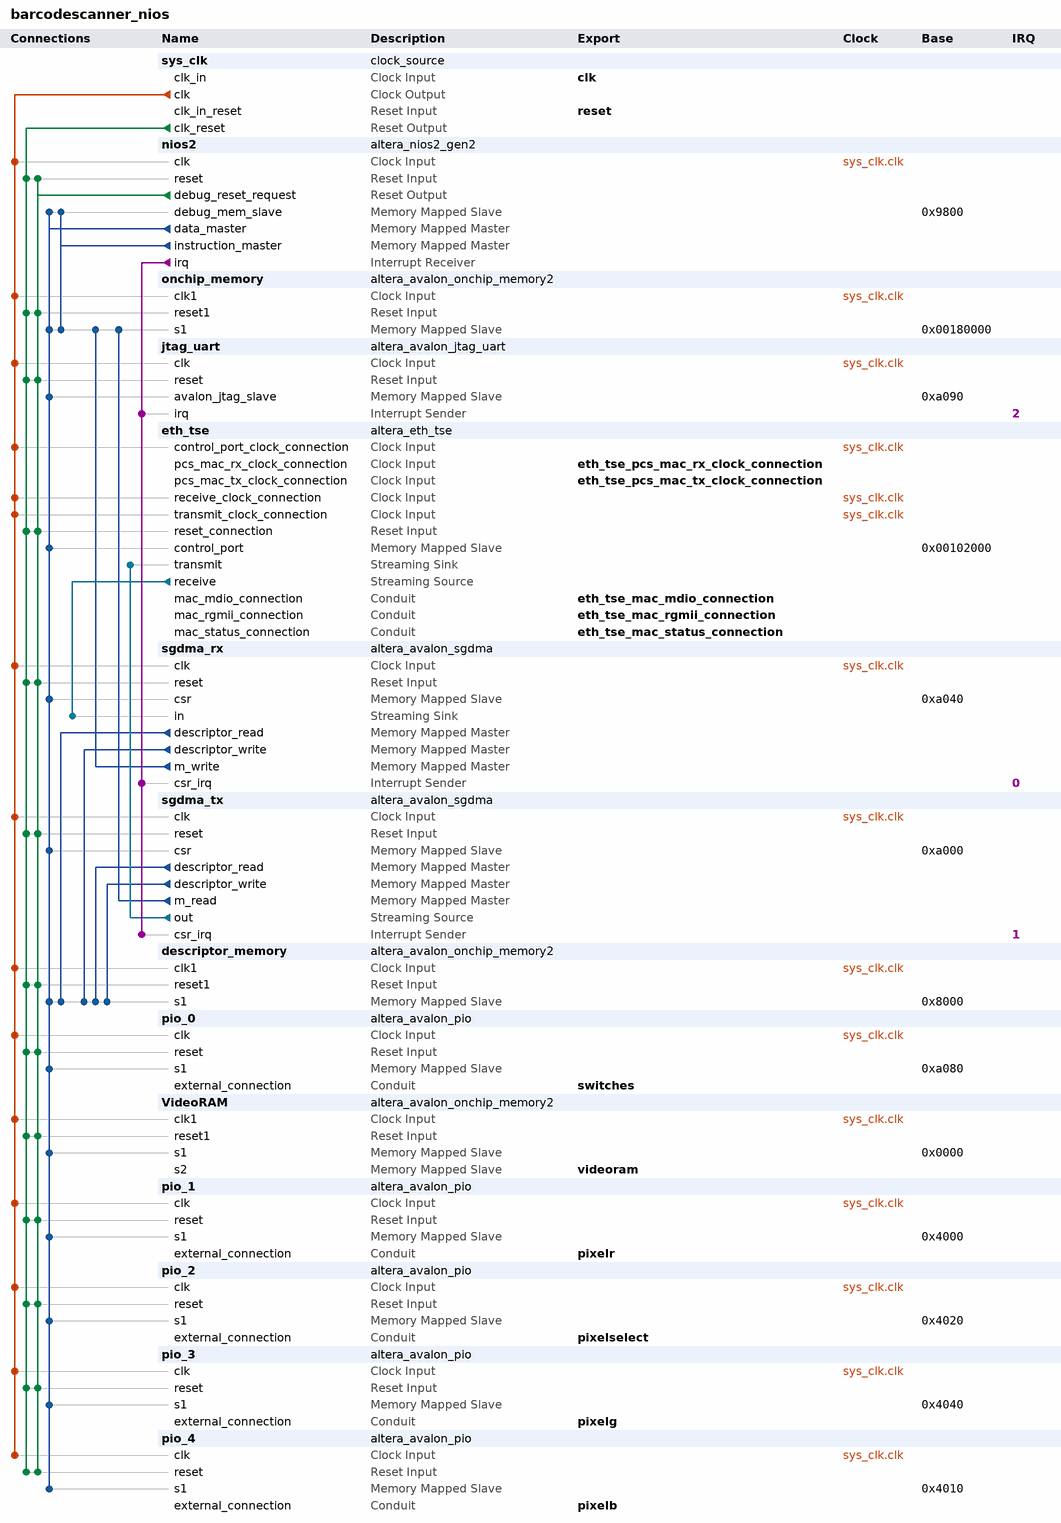
[diagram p0: system contents]
# Platform Designer (Qsys) system barcodescanner_nios, Cyclone IV E EP4CE115F29C7
# Parameters at their usual value, and those the tool derives, are not listed.
package require -exact qsys 18.1
create_system barcodescanner_nios
set_project_property DEVICE_FAMILY {Cyclone IV E}
set_project_property DEVICE EP4CE115F29C7

add_instance sys_clk clock_source 18.1
set_instance_parameter_value sys_clk clockFrequency 50000000

add_instance nios2 altera_nios2_gen2 18.1
set_instance_parameter_value nios2 dcache_size 0
set_instance_parameter_value nios2 exceptionSlave onchip_memory.s1
set_instance_parameter_value nios2 icache_size 4096
set_instance_parameter_value nios2 impl Tiny
set_instance_parameter_value nios2 resetSlave onchip_memory.s1
set_instance_parameter_value nios2 setting_activateTrace true
set_instance_parameter_value nios2 setting_branchpredictiontype Static

add_instance onchip_memory altera_avalon_onchip_memory2 18.1
set_instance_parameter_value onchip_memory dataWidth 32
set_instance_parameter_value onchip_memory dualPort false
set_instance_parameter_value onchip_memory initMemContent true
set_instance_parameter_value onchip_memory initializationFileName onchip_mem.hex
set_instance_parameter_value onchip_memory memorySize 307200

add_instance jtag_uart altera_avalon_jtag_uart 18.1
set_instance_parameter_value jtag_uart simInteractiveOptions NO_INTERACTIVE_WINDOWS

add_instance eth_tse altera_eth_tse 18.1
set_instance_parameter_value eth_tse XCVR_RCFG_JTAG_ENABLE 0
set_instance_parameter_value eth_tse XCVR_SET_CAPABILITY_REG_ENABLE 0
set_instance_parameter_value eth_tse XCVR_SET_CSR_SOFT_LOGIC_ENABLE 0
set_instance_parameter_value eth_tse XCVR_SET_PRBS_SOFT_LOGIC_ENABLE 0
set_instance_parameter_value eth_tse XCVR_SET_USER_IDENTIFIER 0
set_instance_parameter_value eth_tse core_variation MAC_ONLY
set_instance_parameter_value eth_tse enable_hd_logic true
set_instance_parameter_value eth_tse enable_mac_flow_ctrl false
set_instance_parameter_value eth_tse enable_magic_detect true
set_instance_parameter_value eth_tse enable_shift16 true
set_instance_parameter_value eth_tse ifGMII RGMII
set_instance_parameter_value eth_tse ing_addr 11
set_instance_parameter_value eth_tse mdio_clk_div 40
set_instance_parameter_value eth_tse stat_cnt_ena true
set_instance_parameter_value eth_tse transceiver_type NONE

add_instance sgdma_rx altera_avalon_sgdma 18.1
set_instance_parameter_value sgdma_rx enableBurstTransfers false
set_instance_parameter_value sgdma_rx enableUnalignedTransfers false
set_instance_parameter_value sgdma_rx readBlockDataWidth 32
set_instance_parameter_value sgdma_rx sinkErrorWidth 6
set_instance_parameter_value sgdma_rx sourceErrorWidth 0
set_instance_parameter_value sgdma_rx transferMode STREAM_TO_MEMORY
set_instance_parameter_value sgdma_rx writeBurstcountWidth 4

add_instance sgdma_tx altera_avalon_sgdma 18.1
set_instance_parameter_value sgdma_tx enableBurstTransfers false
set_instance_parameter_value sgdma_tx enableUnalignedTransfers false
set_instance_parameter_value sgdma_tx readBlockDataWidth 32
set_instance_parameter_value sgdma_tx sinkErrorWidth 0
set_instance_parameter_value sgdma_tx sourceErrorWidth 1
set_instance_parameter_value sgdma_tx transferMode MEMORY_TO_STREAM
set_instance_parameter_value sgdma_tx writeBurstcountWidth 4

add_instance descriptor_memory altera_avalon_onchip_memory2 18.1
set_instance_parameter_value descriptor_memory dataWidth 32
set_instance_parameter_value descriptor_memory dualPort false
set_instance_parameter_value descriptor_memory initMemContent true
set_instance_parameter_value descriptor_memory initializationFileName onchip_mem.hex
set_instance_parameter_value descriptor_memory memorySize 4096

add_instance pio_0 altera_avalon_pio 18.1
set_instance_parameter_value pio_0 direction Input
set_instance_parameter_value pio_0 width 8

add_instance VideoRAM altera_avalon_onchip_memory2 18.1
set_instance_parameter_value VideoRAM dataWidth 32
set_instance_parameter_value VideoRAM dualPort true
set_instance_parameter_value VideoRAM initMemContent true
set_instance_parameter_value VideoRAM initializationFileName onchip_mem.hex
set_instance_parameter_value VideoRAM memorySize 10000
set_instance_parameter_value VideoRAM singleClockOperation true

add_instance pio_1 altera_avalon_pio 18.1
set_instance_parameter_value pio_1 direction Input
set_instance_parameter_value pio_1 width 8

add_instance pio_2 altera_avalon_pio 18.1
set_instance_parameter_value pio_2 bitModifyingOutReg true
set_instance_parameter_value pio_2 direction Output
set_instance_parameter_value pio_2 width 8

add_instance pio_3 altera_avalon_pio 18.1
set_instance_parameter_value pio_3 direction Input
set_instance_parameter_value pio_3 width 8

add_instance pio_4 altera_avalon_pio 18.1
set_instance_parameter_value pio_4 direction Input
set_instance_parameter_value pio_4 width 8

# connections
add_connection sys_clk.clk descriptor_memory.clk1 clock
add_connection sys_clk.clk eth_tse.control_port_clock_connection clock
add_connection sys_clk.clk eth_tse.receive_clock_connection clock
add_connection sys_clk.clk eth_tse.transmit_clock_connection clock
add_connection sys_clk.clk jtag_uart.clk clock
add_connection sys_clk.clk nios2.clk clock
add_connection sys_clk.clk onchip_memory.clk1 clock
add_connection sys_clk.clk pio_0.clk clock
add_connection sys_clk.clk pio_1.clk clock
add_connection sys_clk.clk pio_2.clk clock
add_connection sys_clk.clk pio_3.clk clock
add_connection sys_clk.clk pio_4.clk clock
add_connection sys_clk.clk sgdma_rx.clk clock
add_connection sys_clk.clk sgdma_tx.clk clock
add_connection sys_clk.clk VideoRAM.clk1 clock
add_connection nios2.debug_reset_request descriptor_memory.reset1 reset
add_connection nios2.debug_reset_request eth_tse.reset_connection reset
add_connection nios2.debug_reset_request jtag_uart.reset reset
add_connection nios2.debug_reset_request nios2.reset reset
add_connection nios2.debug_reset_request onchip_memory.reset1 reset
add_connection nios2.debug_reset_request pio_0.reset reset
add_connection nios2.debug_reset_request pio_1.reset reset
add_connection nios2.debug_reset_request pio_2.reset reset
add_connection nios2.debug_reset_request pio_3.reset reset
add_connection nios2.debug_reset_request pio_4.reset reset
add_connection nios2.debug_reset_request sgdma_rx.reset reset
add_connection nios2.debug_reset_request sgdma_tx.reset reset
add_connection nios2.debug_reset_request VideoRAM.reset1 reset
add_connection sys_clk.clk_reset descriptor_memory.reset1 reset
add_connection sys_clk.clk_reset eth_tse.reset_connection reset
add_connection sys_clk.clk_reset jtag_uart.reset reset
add_connection sys_clk.clk_reset nios2.reset reset
add_connection sys_clk.clk_reset onchip_memory.reset1 reset
add_connection sys_clk.clk_reset pio_0.reset reset
add_connection sys_clk.clk_reset pio_1.reset reset
add_connection sys_clk.clk_reset pio_2.reset reset
add_connection sys_clk.clk_reset pio_3.reset reset
add_connection sys_clk.clk_reset pio_4.reset reset
add_connection sys_clk.clk_reset sgdma_rx.reset reset
add_connection sys_clk.clk_reset sgdma_tx.reset reset
add_connection sys_clk.clk_reset VideoRAM.reset1 reset
add_connection nios2.data_master descriptor_memory.s1 avalon
set_connection_parameter_value nios2.data_master/descriptor_memory.s1 baseAddress 0x8000
add_connection nios2.data_master eth_tse.control_port avalon
set_connection_parameter_value nios2.data_master/eth_tse.control_port baseAddress 0x00102000
add_connection nios2.data_master jtag_uart.avalon_jtag_slave avalon
set_connection_parameter_value nios2.data_master/jtag_uart.avalon_jtag_slave baseAddress 0xa090
add_connection nios2.data_master nios2.debug_mem_slave avalon
set_connection_parameter_value nios2.data_master/nios2.debug_mem_slave baseAddress 0x9800
add_connection nios2.data_master onchip_memory.s1 avalon
set_connection_parameter_value nios2.data_master/onchip_memory.s1 baseAddress 0x00180000
add_connection nios2.data_master pio_0.s1 avalon
set_connection_parameter_value nios2.data_master/pio_0.s1 baseAddress 0xa080
add_connection nios2.data_master pio_1.s1 avalon
set_connection_parameter_value nios2.data_master/pio_1.s1 baseAddress 0x4000
add_connection nios2.data_master pio_2.s1 avalon
set_connection_parameter_value nios2.data_master/pio_2.s1 baseAddress 0x4020
add_connection nios2.data_master pio_3.s1 avalon
set_connection_parameter_value nios2.data_master/pio_3.s1 baseAddress 0x4040
add_connection nios2.data_master pio_4.s1 avalon
set_connection_parameter_value nios2.data_master/pio_4.s1 baseAddress 0x4010
add_connection nios2.data_master sgdma_rx.csr avalon
set_connection_parameter_value nios2.data_master/sgdma_rx.csr baseAddress 0xa040
add_connection nios2.data_master sgdma_tx.csr avalon
set_connection_parameter_value nios2.data_master/sgdma_tx.csr baseAddress 0xa000
add_connection nios2.data_master VideoRAM.s1 avalon
set_connection_parameter_value nios2.data_master/VideoRAM.s1 baseAddress 0x0000
add_connection nios2.instruction_master nios2.debug_mem_slave avalon
set_connection_parameter_value nios2.instruction_master/nios2.debug_mem_slave baseAddress 0x9800
add_connection nios2.instruction_master onchip_memory.s1 avalon
set_connection_parameter_value nios2.instruction_master/onchip_memory.s1 baseAddress 0x00180000
add_connection sgdma_rx.descriptor_read descriptor_memory.s1 avalon
set_connection_parameter_value sgdma_rx.descriptor_read/descriptor_memory.s1 baseAddress 0x8000
add_connection sgdma_rx.descriptor_write descriptor_memory.s1 avalon
set_connection_parameter_value sgdma_rx.descriptor_write/descriptor_memory.s1 baseAddress 0x8000
add_connection sgdma_rx.m_write onchip_memory.s1 avalon
set_connection_parameter_value sgdma_rx.m_write/onchip_memory.s1 baseAddress 0x00180000
add_connection sgdma_tx.descriptor_read descriptor_memory.s1 avalon
set_connection_parameter_value sgdma_tx.descriptor_read/descriptor_memory.s1 baseAddress 0x8000
add_connection sgdma_tx.descriptor_write descriptor_memory.s1 avalon
set_connection_parameter_value sgdma_tx.descriptor_write/descriptor_memory.s1 baseAddress 0x8000
add_connection sgdma_tx.m_read onchip_memory.s1 avalon
set_connection_parameter_value sgdma_tx.m_read/onchip_memory.s1 baseAddress 0x00180000
add_connection eth_tse.receive sgdma_rx.in avalon_streaming
add_connection sgdma_tx.out eth_tse.transmit avalon_streaming
add_connection nios2.irq jtag_uart.irq interrupt
set_connection_parameter_value nios2.irq/jtag_uart.irq irqNumber 2
add_connection nios2.irq sgdma_rx.csr_irq interrupt
set_connection_parameter_value nios2.irq/sgdma_rx.csr_irq irqNumber 0
add_connection nios2.irq sgdma_tx.csr_irq interrupt
set_connection_parameter_value nios2.irq/sgdma_tx.csr_irq irqNumber 1

# exported interfaces
add_interface clk clock sink
set_interface_property clk EXPORT_OF sys_clk.clk_in
add_interface eth_tse_mac_mdio_connection conduit end
set_interface_property eth_tse_mac_mdio_connection EXPORT_OF eth_tse.mac_mdio_connection
add_interface eth_tse_mac_rgmii_connection conduit end
set_interface_property eth_tse_mac_rgmii_connection EXPORT_OF eth_tse.mac_rgmii_connection
add_interface eth_tse_mac_status_connection conduit end
set_interface_property eth_tse_mac_status_connection EXPORT_OF eth_tse.mac_status_connection
add_interface eth_tse_pcs_mac_rx_clock_connection clock sink
set_interface_property eth_tse_pcs_mac_rx_clock_connection EXPORT_OF eth_tse.pcs_mac_rx_clock_connection
add_interface eth_tse_pcs_mac_tx_clock_connection clock sink
set_interface_property eth_tse_pcs_mac_tx_clock_connection EXPORT_OF eth_tse.pcs_mac_tx_clock_connection
add_interface pixelb conduit end
set_interface_property pixelb EXPORT_OF pio_4.external_connection
add_interface pixelg conduit end
set_interface_property pixelg EXPORT_OF pio_3.external_connection
add_interface pixelr conduit end
set_interface_property pixelr EXPORT_OF pio_1.external_connection
add_interface pixelselect conduit end
set_interface_property pixelselect EXPORT_OF pio_2.external_connection
add_interface reset reset sink
set_interface_property reset EXPORT_OF sys_clk.clk_in_reset
add_interface switches conduit end
set_interface_property switches EXPORT_OF pio_0.external_connection
add_interface videoram avalon slave
set_interface_property videoram EXPORT_OF VideoRAM.s2

set_interconnect_requirement {$system} qsys_mm.clockCrossingAdapter HANDSHAKE
set_interconnect_requirement {$system} qsys_mm.enableEccProtection FALSE
set_interconnect_requirement {$system} qsys_mm.insertDefaultSlave FALSE
set_interconnect_requirement {$system} qsys_mm.maxAdditionalLatency 1

save_system barcodescanner_nios.qsys
